# EAGLE schematic IMU_Breakout_SCH_E.sch.eagle (EAGLE 9.5.0)

## Sheet 1 of 2
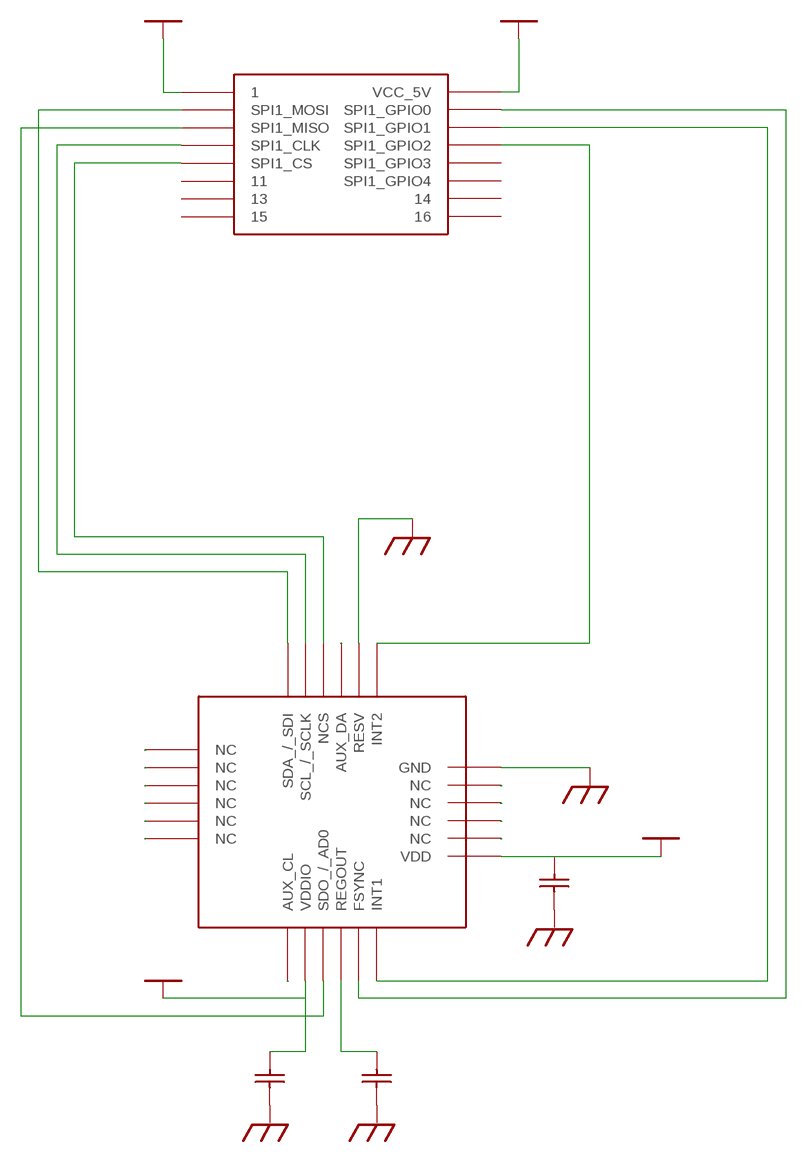
[diagram p0: schematic, sheet 1]

### Parts
C1  C0805X104K5RAC3316  (no package)
C2  C0805X104K5RAC3316  (no package)
C3  C0805X104K5RAC3316  (no package)
GND1  GND  (no package)
GND2  GND  (no package)
GND3  GND  (no package)
GND4  GND  (no package)
GND5  GND  (no package)
PP51  +5  (no package)
PVCC_3V31  VCC_3V3  (no package)
PVCC_3V32  VCC_3V3  (no package)
PVCC_3V33  VCC_3V3  (no package)
U1  ICM_20649  (no package)
U2  BREAKOUT_PORT  (no package)

### Nets
+5: PP51.PWR U2.VCC_5V
GND: GND2.GND U1.GND
N$1: C3.2 PVCC_3V32.PWR U1.VDDIO
N$2: GND5.GND U1.RESV
N$3: U1.NC
N$5: U1.NC
N$7: U1.NC
N$9: U1.NC
N$11: U1.NC
N$13: U1.NC
N$15: U1.NC
N$17: U1.NC
N$19: U1.NC
N$21: U1.NC
N$23: U1.AUX_CL
N$25: C1.1 GND1.GND
N$26: C2.1 GND3.GND
N$27: C3.1 GND4.GND
NETC1_2: C1.2 U1.REGOUT
NETU1_9: U1.SDO_/_AD0 U2.SPI1_MISO
NETU1_11: U1.FSYNC U2.SPI1_GPIO0
NETU1_12: U1.INT1 U2.SPI1_GPIO1
NETU1_19: U1.INT2 U2.SPI1_GPIO2
NETU1_22: U1.NCS U2.SPI1_CS
NETU1_23: U1.SCL_/_SCLK U2.SPI1_CLK
NETU1_24: U1.SDA_/_SDI U2.SPI1_MOSI
VCC_3V3: C2.2 PVCC_3V31.PWR PVCC_3V33.PWR U1.VDD U2.1
Unconnected: U1.AUX_DA U2.11 U2.13 U2.14 U2.15 U2.16 U2.SPI1_GPIO3 U2.SPI1_GPIO4

## Sheet 2 of 2
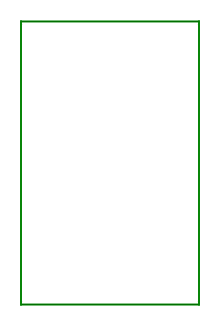
[diagram p1: schematic, sheet 2]

## Library data of the parts
C1-C3 = IMU_Breakout_SCH_E:C0805X104K5RAC3316; COMMENT: .1uF
GND1-GND5 = IMU_Breakout_SCH_E:GND
PP51 = IMU_Breakout_SCH_E:+5
PVCC_3V31-PVCC_3V33 = IMU_Breakout_SCH_E:VCC_3V3
U1 = IMU_Breakout_SCH_E:ICM_20649; COMMENT: ICM_20649
U2 = IMU_Breakout_SCH_E:BREAKOUT_PORT; COMMENT: Breakout_Port